# Altium schematic sheet BuckAndOutputCircuits. Page 2.SchDoc
size 420 x 297 mm; Address1: Address1; Address2: Address2; Address3: Address3; Address4: Address4; DocumentNumber: АБВГ.123456.001 Э3; SheetNumber: 2; SheetTotal: 3; Scale: 1:1; DocumentType: Схема электрическая принципиальная; FirstReferrence: АБВГ.123456.001
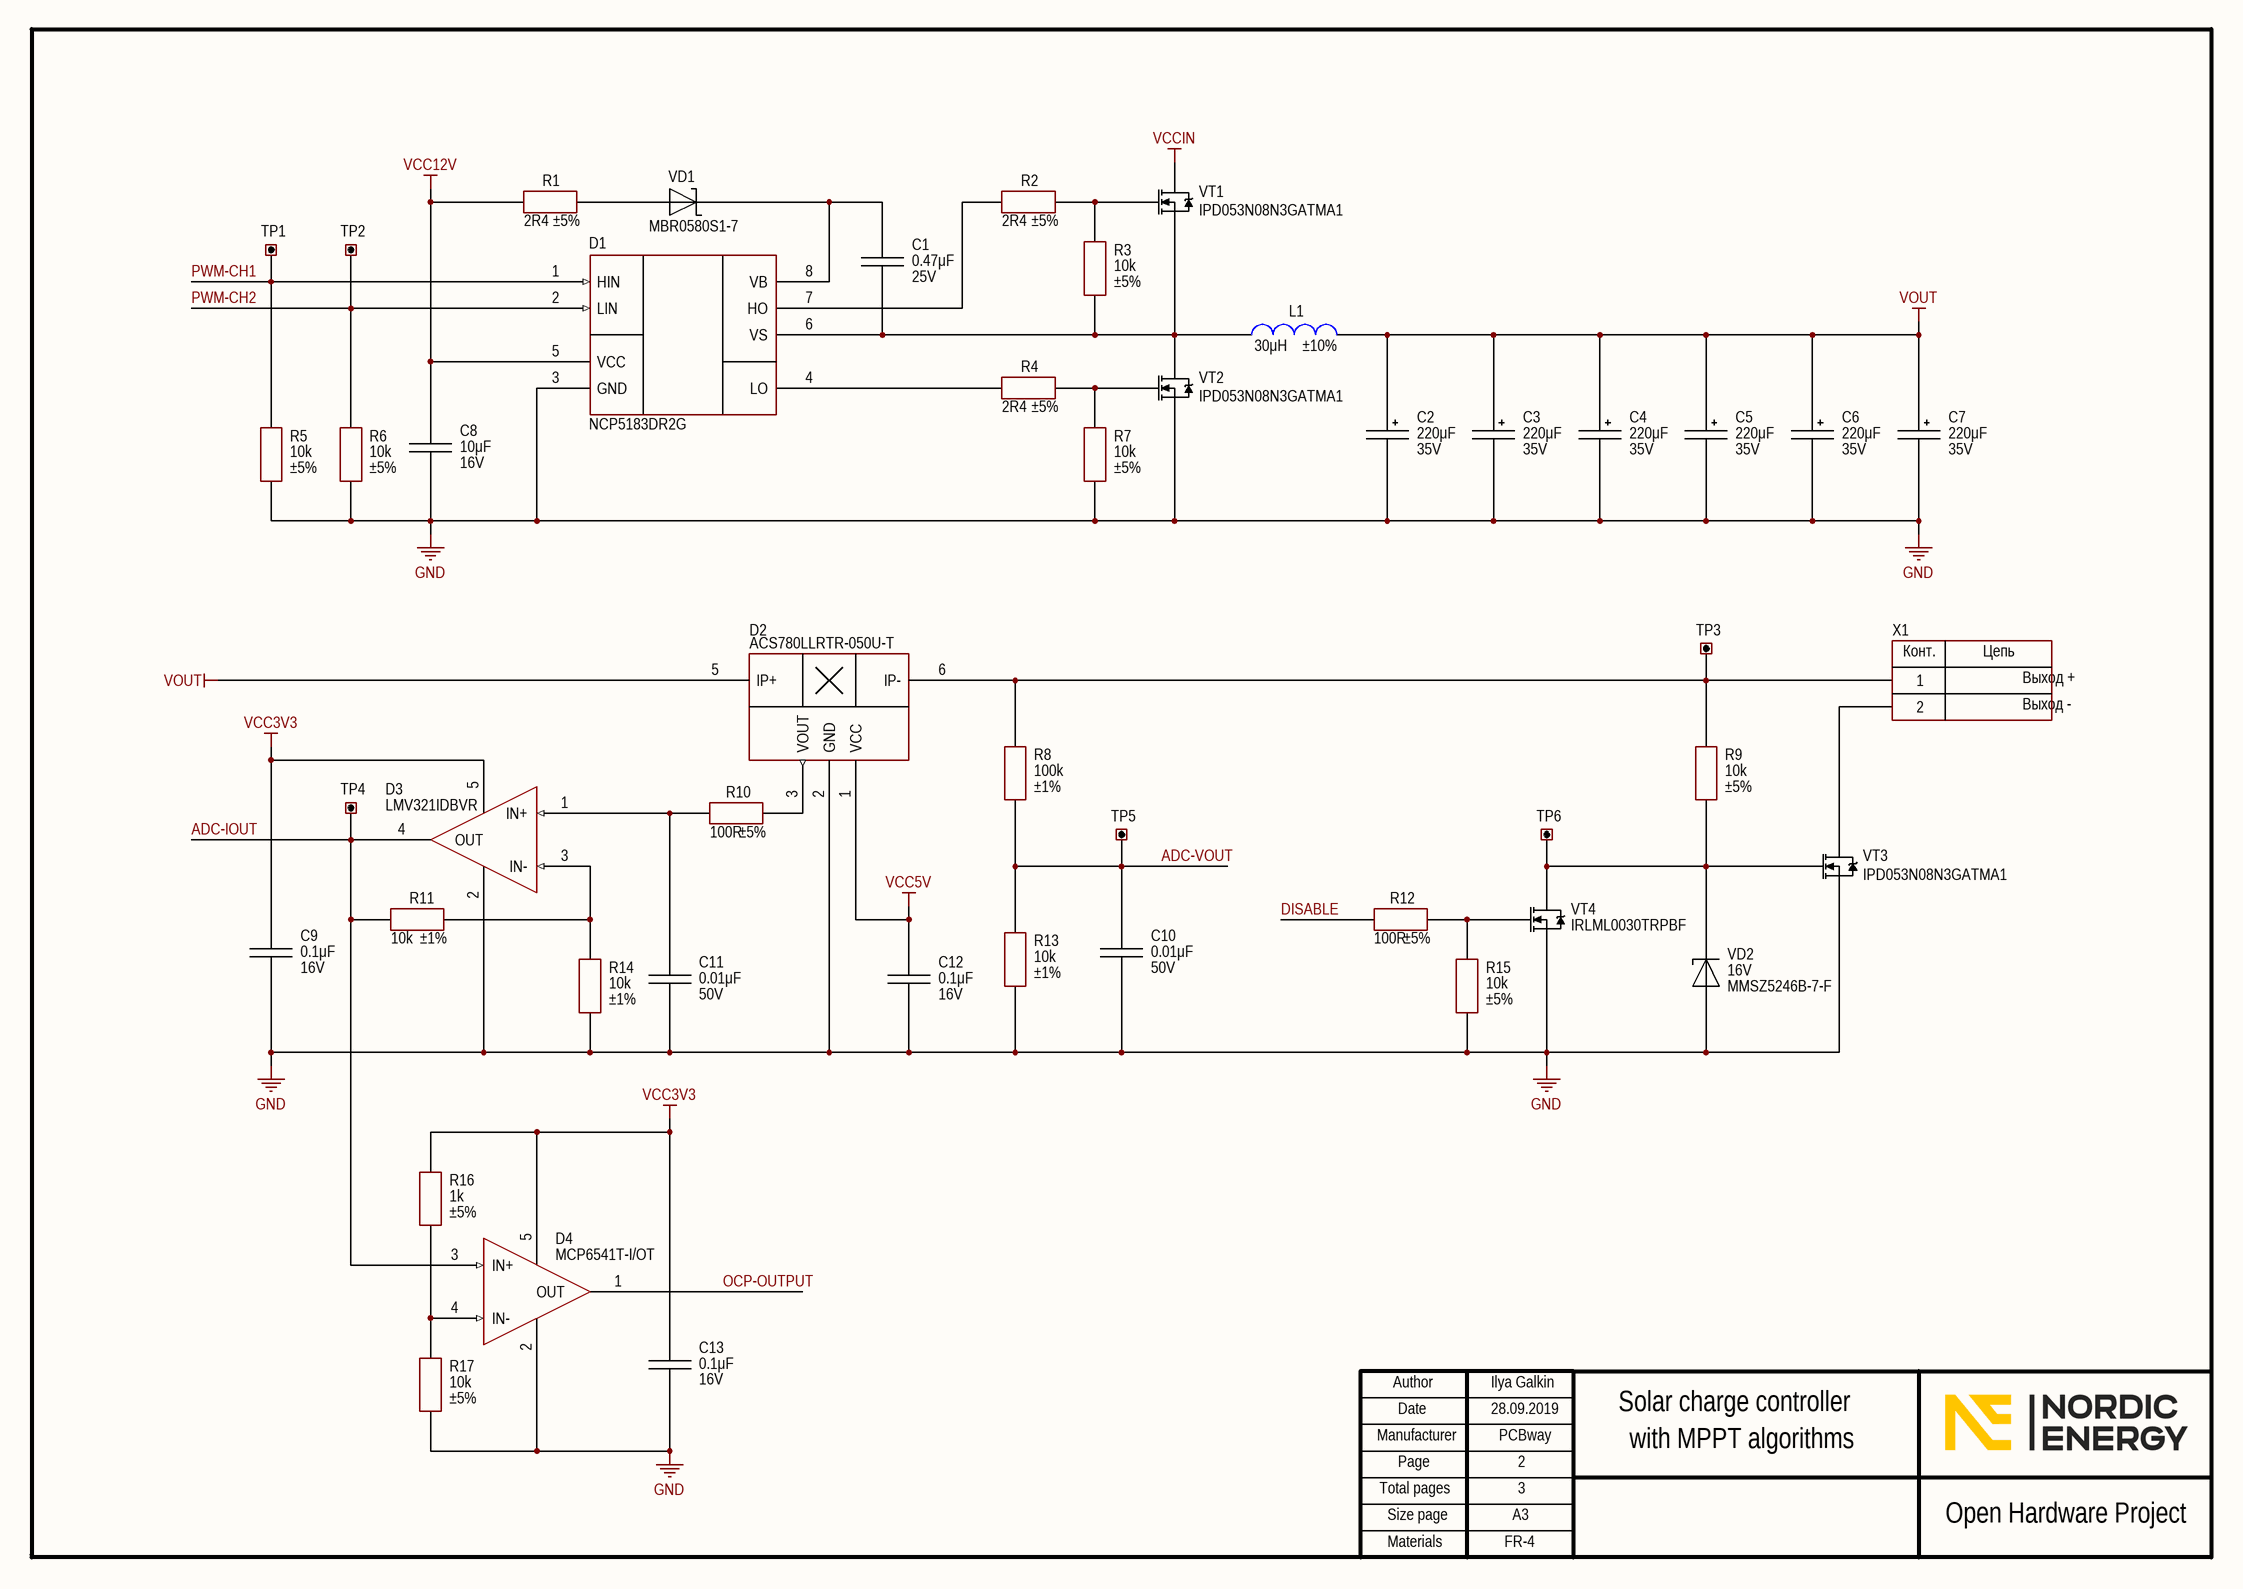
[diagram p0: BuckAndOutputCircuits. Page 2.SchDoc]

## Parts
C1  value 0.47μF  Voltage: 25V  [CAP: 0805]
C2  value 220μF  Voltage: 35V  [CAP: D6.3C2.5H11]
C3  value 220μF  Voltage: 35V  [CAP: D6.3C2.5H11]
C4  value 220μF  Voltage: 35V  [CAP: D6.3C2.5H11]
C5  value 220μF  Voltage: 35V  [CAP: D6.3C2.5H11]
C6  value 220μF  Voltage: 35V  [CAP: D6.3C2.5H11]
C7  value 220μF  Voltage: 35V  [CAP: D6.3C2.5H11]
C8  value 10μF  Voltage: 16V  [CAP: 0805]
C9  value 0.1μF  Voltage: 16V  [CAP: 0805]
C10  value 0.01μF  Voltage: 50V  [CAP: 0805]
C11  value 0.01μF  Voltage: 50V  [CAP: 0805]
C12  value 0.1μF  Voltage: 16V  [CAP: 0805]
C13  value 0.1μF  Voltage: 16V  [CAP: 0805]
D1  (no value)  [8-SOIC]
D2  PartNumber: ACS780LLRTR-050U-T  [SENSOR: ACS781]
D3  (no value)  [SOT23-5]
D4  (no value)  [SOT23-5]
L1  value 30μH  Tolerance: ±10%  [IND: R32.8/20.1/10.7 (L)]
R1  value 2R4  Tolerance: ±5%  [RES: 0805]
R2  value 2R4  Tolerance: ±5%  [RES: 0805]
R3  value 10k  Tolerance: ±5%  [RES: 0805]
R4  value 2R4  Tolerance: ±5%  [RES: 0805]
R5  value 10k  Tolerance: ±5%  [RES: 0805]
R6  value 10k  Tolerance: ±5%  [RES: 0805]
R7  value 10k  Tolerance: ±5%  [RES: 0805]
R8  value 100k  Tolerance: ±1%  [RES: 0805]
R9  value 10k  Tolerance: ±5%  [RES: 0805]
R10  value 100R  Tolerance: ±5%  [RES: 0805]
R11  value 10k  Tolerance: ±1%  [RES: 0805]
R12  value 100R  Tolerance: ±5%  [RES: 0805]
R13  value 10k  Tolerance: ±1%  [RES: 0805]
R14  value 10k  Tolerance: ±1%  [RES: 0805]
R15  value 10k  Tolerance: ±5%  [RES: 0805]
R16  value 1k  Tolerance: ±5%  [RES: 0805]
R17  value 10k  Tolerance: ±5%  [RES: 0805]
TP1  (no value)  [CON: 5001 (Keystone)]
TP2  (no value)  [CON: 5001 (Keystone)]
TP3  (no value)  [CON: 5001 (Keystone)]
TP4  (no value)  [CON: 5004 (Keystone)]
TP5  (no value)  [CON: 5004 (Keystone)]
TP6  (no value)  [CON: 5001 (Keystone)]
VD1  PartNumber: MBR0580S1-7  [DIODE: SOD123]
VD2  Voltage: 16V  PartNumber: MMSZ5246B-7-F  [DIODE: SOD123]
VT1  PartNumber: IPD053N08N3GATMA1  [DPAK]
VT2  PartNumber: IPD053N08N3GATMA1  [DPAK]
VT3  PartNumber: IPD053N08N3GATMA1  [DPAK]
VT4  PartNumber: IRLML0030TRPBF  [SOT23]
X1  (no value)  [CON: 6PCV-02-006]

## Nets
GND: C2.2 C3.2 C4.2 C5.2 C6.2 C7.2 C8.1 C9.1 C10.1 C11.1 C12.1 C13.1 D1.3(GND) D2.2(GND) D3.2(V-) D4.2(V-) R5.2 R6.2 R7.2 R13.2 R14.2 R15.2 R17.2 VD2.1(A) VT2.2(S) VT3.2(S) VT4.2(S)
VCC3V3: C9.2 C13.2 D3.5(V+) D4.5(V+) R16.1
VCC5V: C12.2 D2.1(VCC)
VCC12V: C8.2 D1.5(VCC) R1.1
VCCIN: VT1.3(D)
VOUT: C2.1 C3.1 C4.1 C5.1 C6.1 C7.1 D2.5(IP+) L1.1
ADC-IOUT: D3.4(OUT) D4.3(IN+) R11.1 TP4.1
ADC-VOUT: C10.2 R8.2 R13.1 TP5.1
DISABLE: R12.1
OCP-OUTPUT: D4.1(OUT)
PWM-CH1: D1.1(HIN) R5.1 TP1.1
PWM-CH2: D1.2(LIN) R6.1 TP2.1
NetC1_1: C1.1 D1.6(VS) L1.2 R3.2 VT1.2(S) VT2.3(D)
NetC1_2: C1.2 D1.8(VB) VD1.2
NetC11_2: C11.2 D3.1(IN+) R10.1
NetD1_4: D1.4(LO) R4.1
NetD1_7: D1.7(HO) R2.1
NetD2_3: D2.3(VOUT) R10.2
NetD2_6: D2.6(IP-) R8.1 R9.1 TP3.1 X1.1
NetD3_3: D3.3(IN-) R11.2 R14.1
NetD4_4: D4.4(IN-) R16.2 R17.1
NetR1_2: R1.2 VD1.1
NetR2_2: R2.2 R3.1 VT1.1(G)
NetR4_2: R4.2 R7.1 VT2.1(G)
NetR9_2: R9.2 TP6.1 VD2.2(C) VT3.1(G) VT4.3(D)
NetR12_2: R12.2 R15.1 VT4.1(G)
NetVT3_3: VT3.3(D) X1.2

## Notes on the sheet
- Выход +
- Выход -
- Ilya Galkin
- 28.09.2019
- PCBway
- 2
- Solar charge controller
- with MPPT algorithms
- 3
- FR-4
- Author
- Manufacturer
- Date
- Page
- Total pages
- Size page
- A3
- Open Hardware Project
- Materials
- (in symbol Connector_6PCV-02) Конт.; Цепь

## Library data of the parts
C1 = Ceramic_0805: Manufacturer: Yageo; PartNumber: CC0805KKX7R8BB474; ValueManufacturerPartNumber: Ceramic capacitor, 0.47μF, X7R, ±10%, 25V, 0805, -55...+125°C; TypeCapacitor: Ceramic capacitor; Tolerance: ±10%; TypeDielectric: X7R; Package: 0805; HelpURL: https://www.digikey.com/product-detail/en/yageo/CC0805KKX7R8BB474/311-1364-1-ND/2103148; Temperature: -55...+125°C
C2-C7 = Aluminium: Manufacturer: Aihua Group; PartNumber: SPZ1VM221E12O00; ValueManufacturerPartNumber: Aluminium polymer capacitor, 220μF, 35V, ±20%, 30mOhm, 12x6.3x2.5 mm, -55...+105°C; TypeCapacitor: Aluminium polymer capacitor; Tolerance: ±20%; Impedance: 30mOhm; Package: 12x6.3x2.5 mm; HelpURL: https://lcsc.com/product-detail/Solid-Polymer-Electrolytic-Capacitor_220uF-35V_C171433.html; Temperature: -55...+105°C
C8 = Ceramic_0805: Manufacturer: Samsung; PartNumber: CL21B106KOQNNNG; ValueManufacturerPartNumber: Ceramic capacitor, 10μF, X7R, ±10%, 16V, 0805, -55...+125°C; TypeCapacitor: Ceramic capacitor; Tolerance: ±10%; TypeDielectric: X7R; Package: 0805; HelpURL: https://www.digikey.com/product-detail/en/samsung-electro-mechanics/CL21B106KOQNNNG/1276-6472-1-ND/5958100; Temperature: -55...+125°C
C9 C12 C13 = Ceramic_0805: Manufacturer: Yageo; PartNumber: CC0805KRX7R7BB104; ValueManufacturerPartNumber: Ceramic capacitor, 0.1μF, X7R, ±10%, 16V, 0805, -55...+125°C; TypeCapacitor: Ceramic capacitor; Tolerance: ±10%; TypeDielectric: X7R; Package: 0805; HelpURL: https://www.digikey.com/product-detail/en/yageo/CC0805KRX7R7BB104/311-1142-1-ND/303052; Temperature: -55...+125°C
C10 C11 = Ceramic_0805: Manufacturer: Yageo; PartNumber: CC0805KRX7R9BB103; ValueManufacturerPartNumber: Ceramic capacitor, 0.01μF, X7R, ±10%, 50V, 0805, -55...+125°C; TypeCapacitor: Ceramic capacitor; Tolerance: ±10%; TypeDielectric: X7R; Package: 0805; HelpURL: https://www.digikey.com/product-detail/en/yageo/CC0805KRX7R9BB103/311-1136-1-ND/303046; Temperature: -55...+125°C
D1 = NCP5183DR2G: Gate driver; Manufacturer: ON Semiconductor; ValueManufacturerPartNumber: Half-bridge gate driver, 600V, 500kHz, ±4.3A, supply 9...18V, -40...+125°C, 8-SOIC; VoltageSupply: supply 9...18V; Frequency: 500kHz; CurrentOutput: ±4.3A; VoltageWork: 600V; HelpURL: https://www.digikey.com/product-detail/en/on-semiconductor/NCP5183DR2G/NCP5183DR2GOSCT-ND/7066807; Package: 8-SOIC; ComponentType: Half-bridge gate driver; Temperature: -40...+125°C; PartNumber: NCP5183DR2G
D2 = ACS780: Current sensors; Manufacturer: Allegro MicroSystems; ValueManufacturerPartNumber: IC current sensors, 50A, ±1.5%, 120 kHz, 60mV/A, -40...+150°C, 7-PSOF; Supply: 4.5...5.5V; Accuracy: ±1.5%; GainBandwidth: 120 kHz; Sensitivity: 60mV/A; Sensing: 50A; HelpURL: https://www.digikey.com/product-detail/en/allegro-microsystems-llc/ACS780LLRTR-050U-T/620-1818-1-ND/6189107; Package: 7-PSOF; ComponentType: IC current sensors; Temperature: -40...+150°C
D3 = LMV321IDBVR: OP amplifier; Manufacturer: Texas Instruments; ValueManufacturerPartNumber: IC op amplifier, Rail-to-Rail, 1 MHz, 2.7...5.5V, -40...+125°C, SOT23-5; Supply: 2.7...5.5V; OutputType: Rail-to-Rail; GainBandwidth: 1 MHz; HelpURL: https://www.digikey.com/product-detail/en/texas-instruments/LMV321IDBVR/296-9567-1-ND/379849; Package: SOT23-5; ComponentType: IC op amplifier; Temperature: -40...+125°C; PartNumber: LMV321IDBVR
D4 = MCP6541T-I/OT: Comparator; Manufacturer: Microchip Technology; ValueManufacturerPartNumber: IC comparator, Rail-to-Rail, 1.6...5.5V, -40...+85°C, SOT23-5; Supply: 1.6...5.5V; OutputType: Rail-to-Rail; HelpURL: https://www.digikey.com/product-detail/en/microchip-technology/MCP6541T-I-OT/MCP6541T-I-OTCT-ND/3622387; Package: SOT23-5; ComponentType: IC comparator; Temperature: -40...+85°C; PartNumber: MCP6541T-I/OT
L1 = Inductor_R32.8/20.1/10.7: Manufacturer: Magnetics; PartNumber: 0077548A7; ValueManufacturerPartNumber: Fixed inductor, 30μH, ±10%, R32.8/20.1/10.7, Kool Mu, µ=125, 127 нГн/витков2; TypeInductor: Fixed inductor; TypeMatiriel: Kool Mu; AL: 127 нГн/витков2; MaterialPermeability: µ=125; Package: R32.8/20.1/10.7; HelpURL: http://ferrite.ru/warehouse/r-32-820-110-7-77548-a7.html
R1 R2 R4 = Resistor_0805: Manufacturer: Yageo; PartNumber: RC0805JR-072R4L; ValueManufacturerPartNumber: Resistor film, 2R4, ±5%, 0805, 0.125W, -55...+125°C; TypeResistor: Resistor film; Power: 0.125W; Package: 0805; HelpURL: https://www.digikey.com/product-detail/en/yageo/RC0805JR-072R4L/311-2.4ARCT-ND/731220; Temperature: -55...+125°C
R3 R5-R7 R9 R15 R17 = Resistor_0805: Manufacturer: Yageo; PartNumber: RC0805JR-0710KL; ValueManufacturerPartNumber: Resistor film, 10k, ±5%, 0805, 0.125W, -55...+125°C; TypeResistor: Resistor film; Power: 0.125W; Package: 0805; HelpURL: https://www.digikey.com/product-detail/en/yageo/RC0805JR-0710KL/311-10KARCT-ND/731188; Temperature: -55...+125°C
R8 = Resistor_0805: Manufacturer: Yageo; PartNumber: RC0805FR-07100KL; ValueManufacturerPartNumber: Resistor film, 100k, ±1%, 0805, 0.125W, -55...+125°C; TypeResistor: Resistor film; Power: 0.125W; Package: 0805; HelpURL: https://www.digikey.com/product-detail/en/yageo/RC0805FR-07100KL/311-100KCRCT-ND/730491; Temperature: -55...+125°C
R10 R12 = Resistor_0805: Manufacturer: Yageo; PartNumber: RC0805JR-07100RL; ValueManufacturerPartNumber: Resistor film, 100R, ±5%, 0805, 0.125W, -55...+125°C; TypeResistor: Resistor film; Power: 0.125W; Package: 0805; HelpURL: https://www.digikey.com/product-detail/en/yageo/RC0805JR-07100RL/311-100ARCT-ND/731185; Temperature: -55...+125°C
R11 R13 R14 = Resistor_0805: Manufacturer: Yageo; PartNumber: RC0805FR-0710KL; ValueManufacturerPartNumber: Resistor film, 10k, ±1%, 0805, 0.125W, -55...+125°C; TypeResistor: Resistor film; Power: 0.125W; Package: 0805; HelpURL: https://www.digikey.com/product-detail/en/yageo/RC0805FR-0710KL/311-10.0KCRCT-ND/730482; Temperature: -55...+125°C
R16 = Resistor_0805: Manufacturer: Yageo; PartNumber: RC0805JR-071KL; ValueManufacturerPartNumber: Resistor film, 1k, ±5%, 0805, 0.125W, -55...+125°C; TypeResistor: Resistor film; Power: 0.125W; Package: 0805; HelpURL: https://www.digikey.com/product-detail/en/yageo/RC0805JR-071KL/311-1.0KARCT-ND/731165; Temperature: -55...+125°C
TP1-TP6 = Connector_Test_Point: Manufacturer: Keystone; ValueManufacturerPartNumber: Test point, Keystone, 5001; PartNumber: 5001; TypeConnector: Test point; HelpURL: https://www.digikey.com/product-detail/en/keystone-electronics/5001/36-5001-ND/255327
VD1 = Schottky_single: Manufacturer: Diodes Incorporated; ValueManufacturerPartNumber: Schottky diode, 80V, 500mA, 1V, 15pF, SOD-123, -55...+150°C; TypeDiode: Schottky diode; Voltage: 80V; Current: 500mA; VoltageDrop: 1V; RecoveryTime: 15pF; Package: SOD-123; HelpURL: https://www.digikey.com/product-detail/en/diodes-incorporated/MBR0580S1-7/MBR0580S1-7DICT-ND/5080371; Temperature: -55...+150°C
VD2 = Zener_single: Manufacturer: Diodes Incorporated; ValueManufacturerPartNumber: Zener diode, 16V, 500mW, 0.9V, 17Ohm, SOD-123, -65...+150°C; TypeDiode: Zener diode; Current: 500mW; VoltageDrop: 0.9V; RecoveryTime: 17Ohm; Package: SOD-123; HelpURL: https://www.digikey.com/product-detail/en/diodes-incorporated/MMSZ5246B-7-F/MMSZ5246B-FDICT-ND/717912; Temperature: -65...+150°C
VT1-VT3 = MOSFET_N_132: Manufacturer: Infineon Technologies; ValueManufacturerPartNumber: MOSFET N-channel transistor, 80V, 90A, 69nC, 150W, 5.3mOhm, 4750pF, Dpak, -55...+150°C; TypeTransistor: MOSFET N-channel transistor; VoltageDS: 80V; CurrentDS: 90A; RDS: 5.3mOhm; GateCharge: 69nC; InputCapacitor: 4750pF; MaxPower: 150W; Package: Dpak; HelpURL: https://www.digikey.com/product-detail/en/infineon-technologies/IPD053N08N3GATMA1/IPD053N08N3GATMA1CT-ND/5353500; Temperature: -55...+150°C
VT4 = MOSFET_N_132: Manufacturer: Infineon Technologies; ValueManufacturerPartNumber: MOSFET N-channel transistor, 30V, 5.3A, 2.6nC, 2.5W, 27mOhm, 382pF, SOT-23, -55...+150°C; TypeTransistor: MOSFET N-channel transistor; VoltageDS: 30V; CurrentDS: 5.3A; RDS: 27mOhm; GateCharge: 2.6nC; InputCapacitor: 382pF; MaxPower: 2.5W; Package: SOT-23; HelpURL: https://www.digikey.com/product-detail/en/infineon-technologies/IRLML0030TRPBF/IRLML0030TRPBFCT-ND/2202231; Temperature: -55...+150°C
X1 = Connector_6PCV-02: Manufacturer: TE Connectivity; ValueManufacturerPartNumber: Connector, 2pin, 9.53mm, 300VAC, 25A; PartNumber: 6PCV-02-006; VoltageMax: 300VAC; Pitch: 9.53mm; CurrentMax: 25A; Multichannel: 2pin; CommentText: "Solar panel"; HelpURL: https://www.digikey.com/products/en?keywords=6PCV-02-006; TypeConnector: Connector